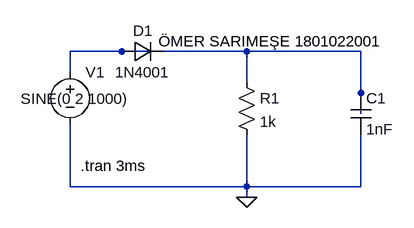
[diagram p0: schematic Draft10.asc]
Draft10.asc, the LTspice schematic file:
Version 4
SHEET 1 880 680
WIRE 64 64 -16 64
WIRE 112 64 64 64
WIRE 256 64 128 64
WIRE 432 64 256 64
WIRE -16 96 -16 64
WIRE 256 112 256 64
WIRE 432 128 432 64
WIRE 432 160 432 128
WIRE -16 272 -16 176
WIRE 256 272 256 192
WIRE 256 272 -16 272
WIRE 432 272 432 192
WIRE 432 272 256 272
WIRE 256 288 256 272
FLAG 256 288 0
SYMBOL res 240 96 R0
SYMATTR InstName R1
SYMATTR Value 1k
SYMBOL cap 416 128 R0
SYMATTR InstName C1
SYMATTR Value 1nF
SYMBOL diode 64 80 R270
WINDOW 0 32 32 VTop 2
WINDOW 3 0 32 VBottom 2
SYMATTR InstName D1
SYMATTR Value 1N4001
SYMBOL voltage -16 80 R0
WINDOW 123 0 0 Left 0
WINDOW 39 0 0 Left 0
WINDOW 3 -76 57 Left 2
SYMATTR InstName V1
SYMATTR Value SINE(0 2 1000)
TEXT 0 240 Left 2 !.tran 3ms
TEXT 120 48 Left 2 !ÖMER SARIMEŞE 1801022001

The netlist it stands for:
* Draft10.asc
R1 N002 0 1k
C1 N002 0 1nF
D1 N001 N002 1N4001
V1 N001 0 SINE(0 2 1000)
.model D D
.lib standard.dio
.tran 3ms
ÖMER SARIMEŞE 1801022001
.backanno
.end